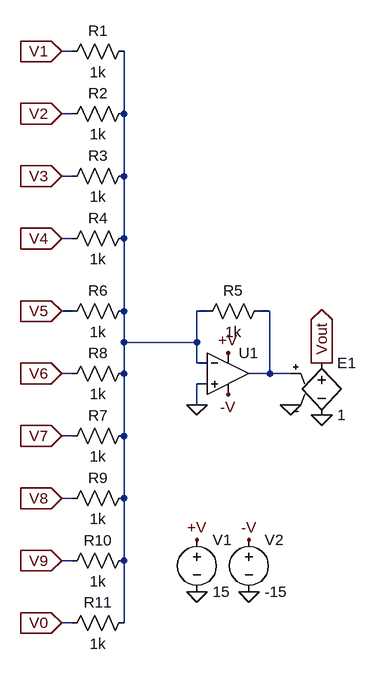
[diagram p0: schematic invert_adder_10.asc]
invert_adder_10.asc, the LTspice schematic file:
Version 4
SHEET 1 880 712
WIRE -32 -352 -48 -352
WIRE -32 -256 -48 -256
WIRE 48 -256 48 -352
WIRE -32 -160 -48 -160
WIRE 48 -160 48 -256
WIRE -32 -64 -48 -64
WIRE 48 -64 48 -160
WIRE -32 48 -48 48
WIRE 48 48 48 -64
WIRE 176 48 160 48
WIRE 272 48 256 48
WIRE 48 96 48 48
WIRE 160 96 160 48
WIRE 160 96 48 96
WIRE 160 128 160 96
WIRE 176 128 160 128
WIRE -32 144 -48 144
WIRE 48 144 48 96
WIRE 272 144 272 48
WIRE 272 144 240 144
WIRE 304 144 272 144
WIRE 176 160 160 160
WIRE 160 192 160 160
WIRE -32 240 -48 240
WIRE 48 240 48 144
WIRE -32 336 -48 336
WIRE 48 336 48 240
WIRE -32 432 -48 432
WIRE 48 432 48 336
WIRE -32 528 -48 528
WIRE 48 528 48 432
FLAG -48 -352 V1
IOPIN -48 -352 In
FLAG 160 192 0
FLAG -48 -256 V2
IOPIN -48 -256 In
FLAG -48 -160 V3
IOPIN -48 -160 In
FLAG -48 -64 V4
IOPIN -48 -64 In
FLAG -48 48 V5
IOPIN -48 48 In
FLAG -48 144 V6
IOPIN -48 144 In
FLAG -48 240 V7
IOPIN -48 240 In
FLAG -48 336 V8
IOPIN -48 336 In
FLAG -48 432 V9
IOPIN -48 432 In
FLAG -48 528 V0
IOPIN -48 528 In
FLAG 160 480 0
FLAG 240 480 0
FLAG 160 400 +V
FLAG 208 112 +V
FLAG 240 400 -V
FLAG 208 176 -V
FLAG 304 192 0
FLAG 352 208 0
FLAG 352 128 Vout
IOPIN 352 128 Out
SYMBOL res 64 -368 R90
WINDOW 0 0 56 VBottom 2
WINDOW 3 32 56 VTop 2
SYMATTR InstName R1
SYMATTR Value 1k
SYMBOL res 64 -176 R90
WINDOW 0 0 56 VBottom 2
WINDOW 3 32 56 VTop 2
SYMATTR InstName R3
SYMATTR Value 1k
SYMBOL res 64 -272 R90
WINDOW 0 0 56 VBottom 2
WINDOW 3 32 56 VTop 2
SYMATTR InstName R2
SYMATTR Value 1k
SYMBOL res 64 -80 R90
WINDOW 0 0 56 VBottom 2
WINDOW 3 32 56 VTop 2
SYMATTR InstName R4
SYMATTR Value 1k
SYMBOL res 272 32 R90
WINDOW 0 0 56 VBottom 2
WINDOW 3 32 56 VTop 2
SYMATTR InstName R5
SYMATTR Value 1k
SYMBOL res 64 32 R90
WINDOW 0 0 56 VBottom 2
WINDOW 3 32 56 VTop 2
SYMATTR InstName R6
SYMATTR Value 1k
SYMBOL res 64 224 R90
WINDOW 0 0 56 VBottom 2
WINDOW 3 32 56 VTop 2
SYMATTR InstName R7
SYMATTR Value 1k
SYMBOL res 64 128 R90
WINDOW 0 0 56 VBottom 2
WINDOW 3 32 56 VTop 2
SYMATTR InstName R8
SYMATTR Value 1k
SYMBOL res 64 320 R90
WINDOW 0 0 56 VBottom 2
WINDOW 3 32 56 VTop 2
SYMATTR InstName R9
SYMATTR Value 1k
SYMBOL res 64 416 R90
WINDOW 0 0 56 VBottom 2
WINDOW 3 32 56 VTop 2
SYMATTR InstName R10
SYMATTR Value 1k
SYMBOL res 64 512 R90
WINDOW 0 0 56 VBottom 2
WINDOW 3 32 56 VTop 2
SYMATTR InstName R11
SYMATTR Value 1k
SYMBOL voltage 160 384 R0
WINDOW 123 0 0 Left 0
WINDOW 39 0 0 Left 0
SYMATTR InstName V1
SYMATTR Value 15
SYMBOL voltage 240 384 R0
WINDOW 123 0 0 Left 0
WINDOW 39 0 0 Left 0
SYMATTR InstName V2
SYMATTR Value -15
SYMBOL e 352 112 R0
SYMATTR InstName E1
SYMATTR Value 1
SYMBOL OpAmps\\UniversalOpAmp1 208 144 R0
SYMATTR InstName U1

The netlist it stands for:
* invert_adder_10.asc
R1 N001 V1 1k
R3 N001 V3 1k
R2 N001 V2 1k
R4 N001 V4 1k
R5 N002 N001 1k
R6 N001 V5 1k
R7 N001 V7 1k
R8 N001 V6 1k
R9 N001 V8 1k
R10 N001 V9 1k
R11 N001 V0 1k
V1 +V 0 15
V2 -V 0 -15
E1 Vout 0 N002 0 1
XU1 0 N001 +V -V N002 level1 Avol=1Meg GBW=10Meg Vos=0 En=0 Enk=0 In=0 Ink=0 Rin=500Meg  ; pins In+ In- V+ V- OUT
.lib UniversalOpAmp1.lib
.backanno
.end